# EAGLE design gbaadapter (EAGLE 7.6.0)
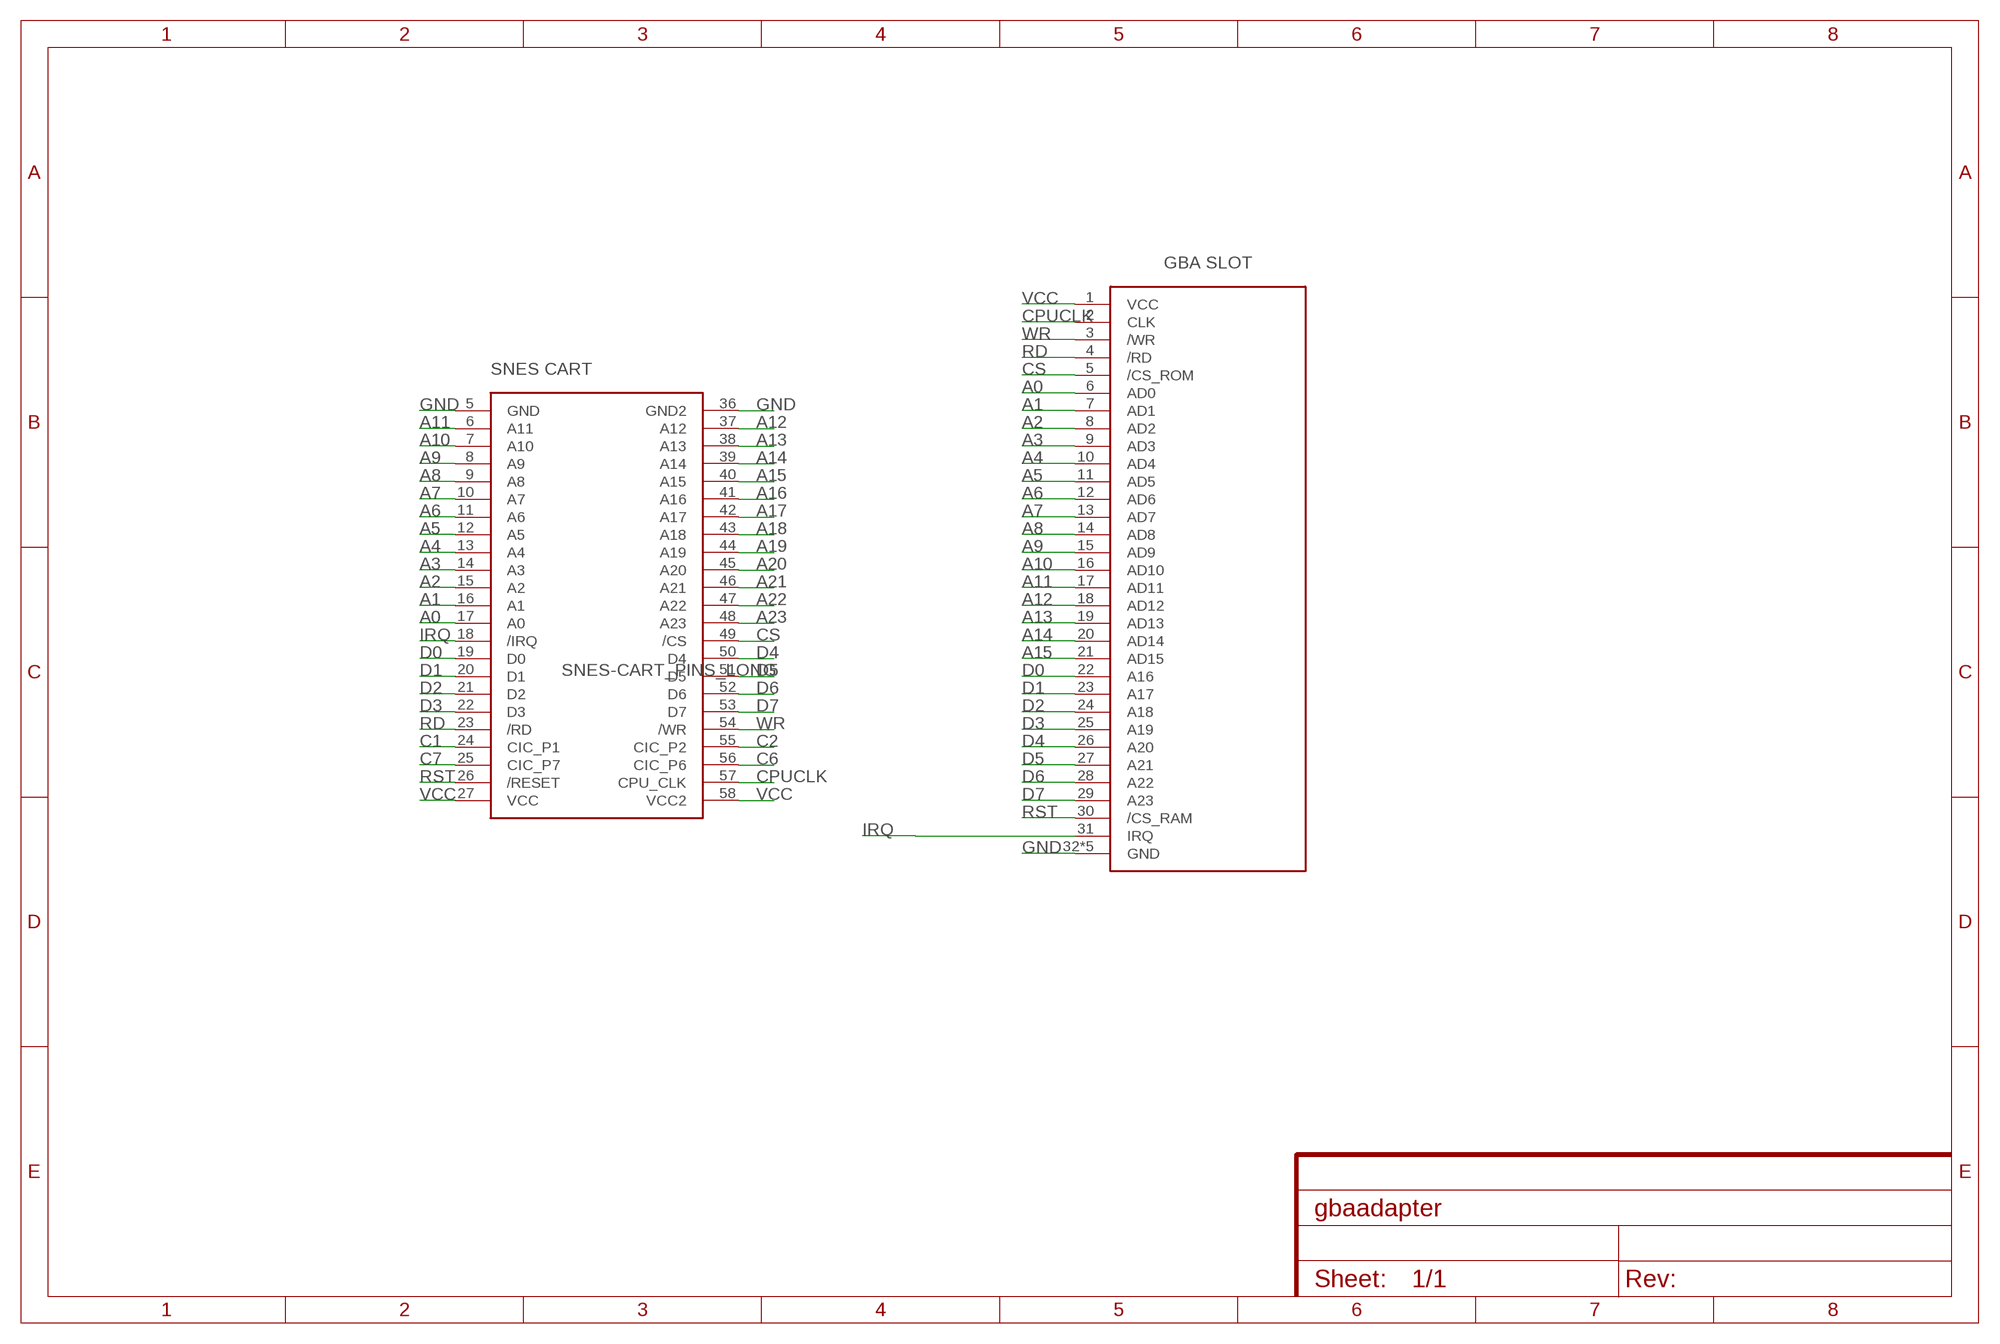
[diagram p0: schematic, sheet 1]

## Parts
U$1  SNES-CART_PINS_LONG  [SNESCART_PINS_LONG]
U$2  GBA-SLOTSMD  [GBA-SLOT]

## Nets
A0: U$1.17(A0) U$2.6(AD0)
A1: U$1.16(A1) U$2.7(AD1)
A2: U$1.15(A2) U$2.8(AD2)
A3: U$1.14(A3) U$2.9(AD3)
A4: U$1.13(A4) U$2.10(AD4)
A5: U$1.12(A5) U$2.11(AD5)
A6: U$1.11(A6) U$2.12(AD6)
A7: U$1.10(A7) U$2.13(AD7)
A8: U$1.9(A8) U$2.14(AD8)
A9: U$1.8(A9) U$2.15(AD9)
A10: U$1.7(A10) U$2.16(AD10)
A11: U$1.6(A11) U$2.17(AD11)
A12: U$1.37(A12) U$2.18(AD12)
A13: U$1.38(A13) U$2.19(AD13)
A14: U$1.39(A14) U$2.20(AD14)
A15: U$1.40(A15) U$2.21(AD15)
A16: U$1.41(A16)
A17: U$1.42(A17)
A18: U$1.43(A18)
A19: U$1.44(A19)
A20: U$1.45(A20)
A21: U$1.46(A21)
A22: U$1.47(A22)
A23: U$1.48(A23)
C1: U$1.24(CIC_P1)
C2: U$1.55(CIC_P2)
C6: U$1.56(CIC_P6)
C7: U$1.25(CIC_P7)
CPUCLK: U$1.57(CPU_CLK) U$2.2(CLK)
CS: U$1.49(/CS) U$2.5(/CS_ROM)
D0: U$1.19(D0) U$2.22(A16)
D1: U$1.20(D1) U$2.23(A17)
D2: U$1.21(D2) U$2.24(A18)
D3: U$1.22(D3) U$2.25(A19)
D4: U$1.50(D4) U$2.26(A20)
D5: U$1.51(D5) U$2.27(A21)
D6: U$1.52(D6) U$2.28(A22)
D7: U$1.53(D7) U$2.29(A23)
GND [gnd]: U$1.5(GND) U$1.36(GND2) U$2.32(GND) U$2.SHIELD_1(GND) U$2.SHIELD_2(GND) U$2.SHIELD_3(GND) U$2.SHIELD_4(GND)
IRQ: U$1.18(/IRQ) U$2.31(IRQ)
RD: U$1.23(/RD) U$2.4(/RD)
RST: U$1.26(/RESET) U$2.30(/CS_RAM)
VCC [power]: U$1.27(VCC) U$1.58(VCC2) U$2.1(VCC)
WR: U$1.54(/WR) U$2.3(/WR)

## Library data of the parts
U$1 = !sanni_mod2:SNES-CART_PINS_LONG
U$2 = !sanni:GBA-SLOT

## Net classes
0 default: width 0.305 mm, drill 0.406 mm, clearance 0.203 mm
1 power: width 0.61 mm, drill 0.406 mm, clearance 0.203 mm
2 gnd: width 0.61 mm, drill 0.406 mm, clearance 0.203 mm

## Board
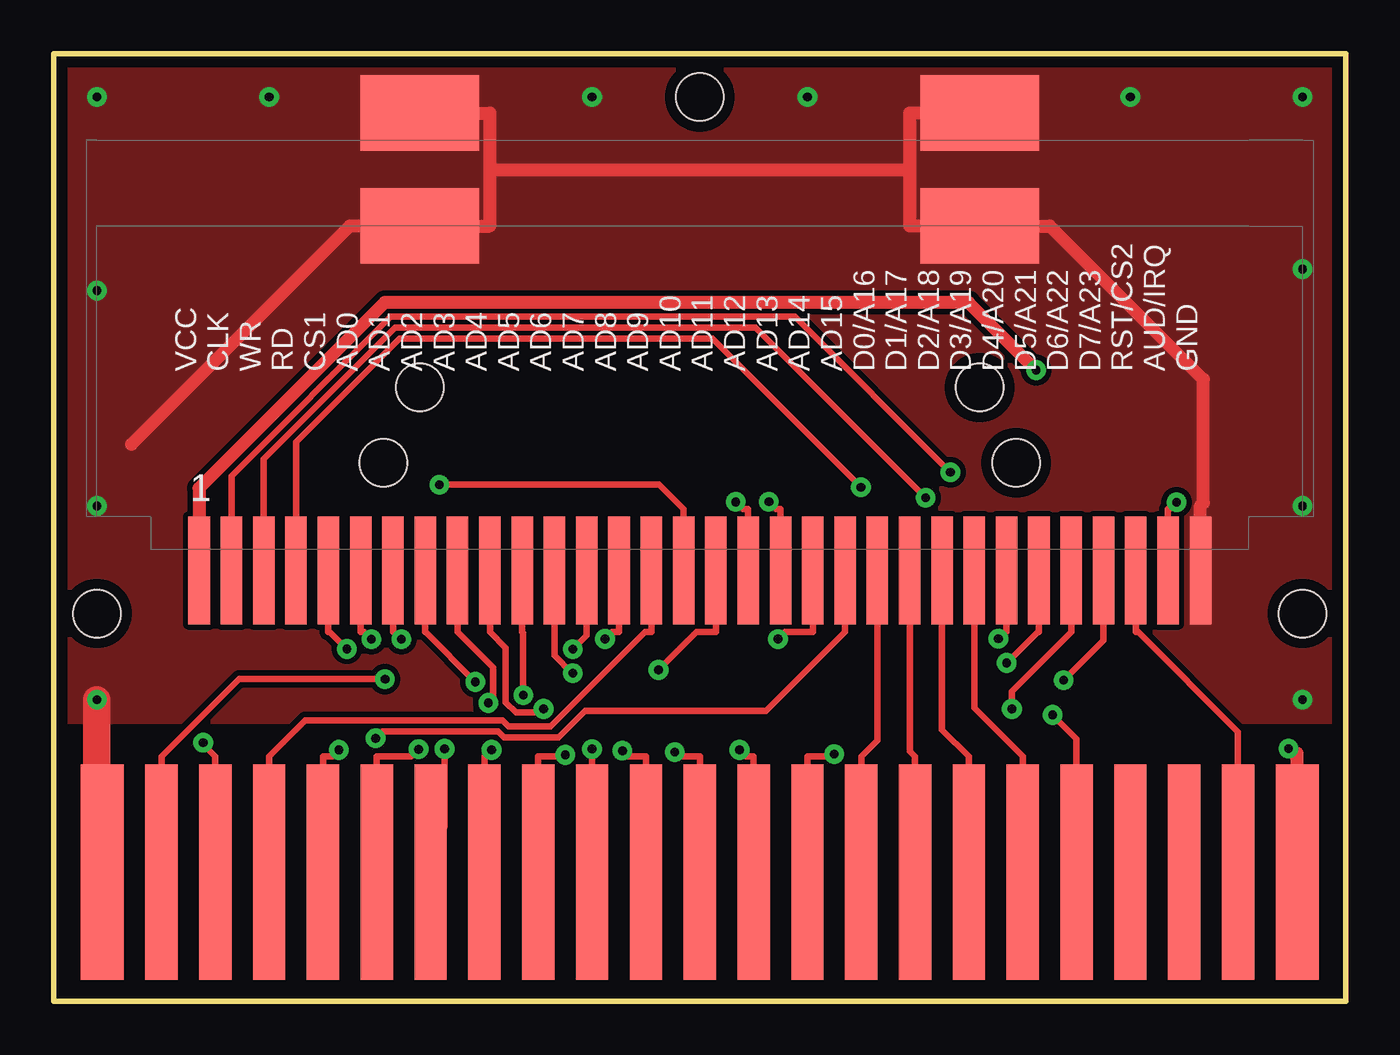
[diagram p1: board, top side]
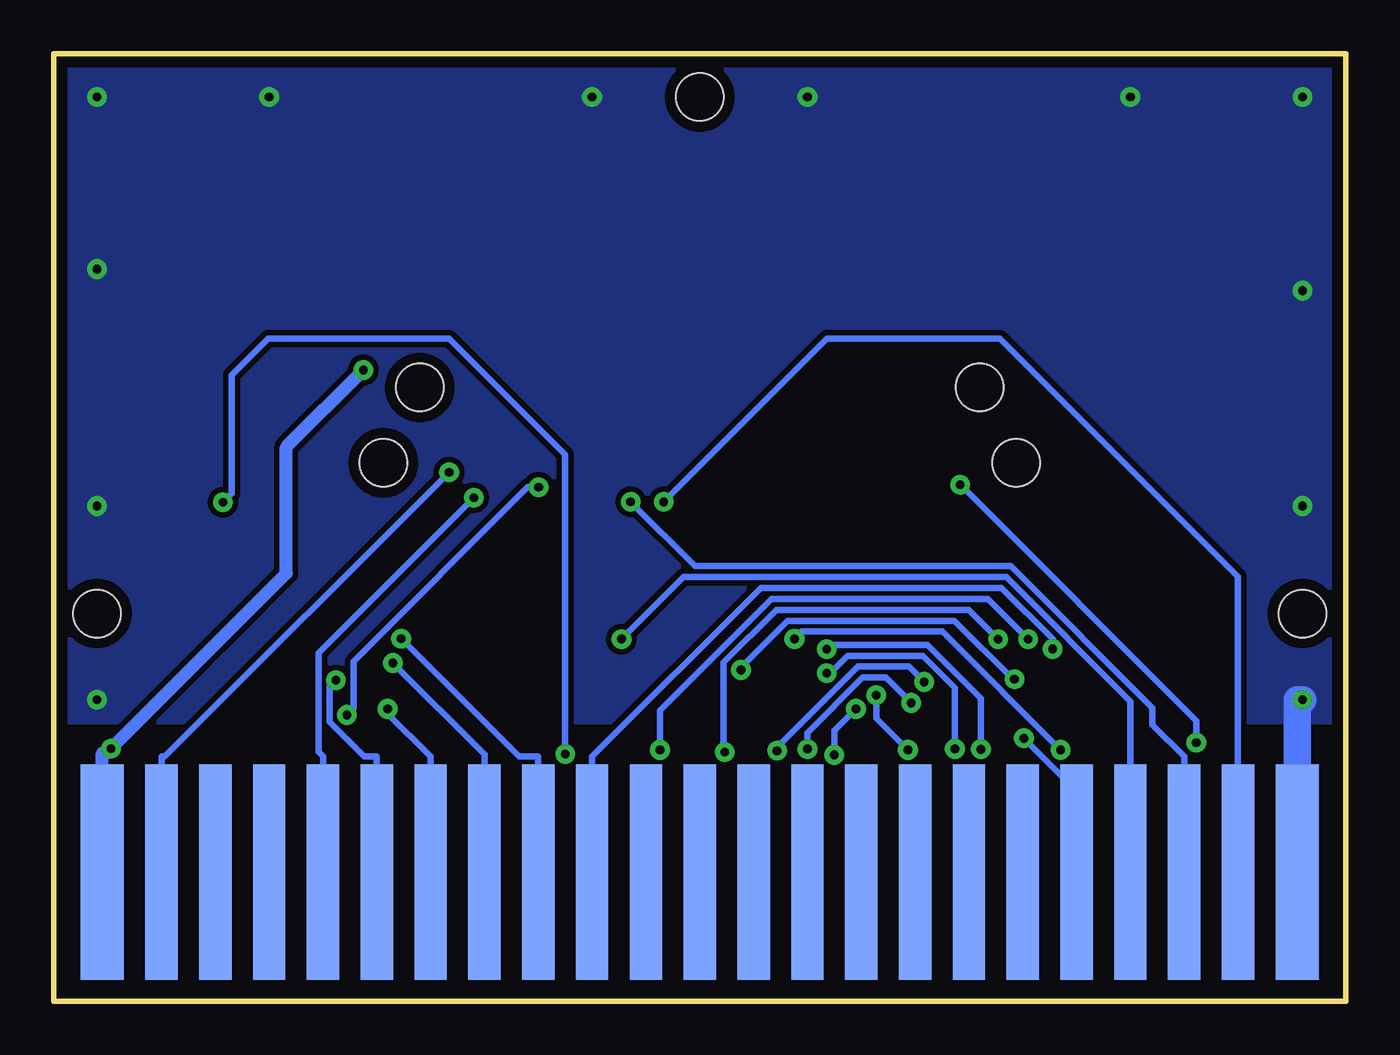
[diagram p2: board, bottom side, seen from below]

Size 60 x 44 mm. Coordinates in mm from the lower left corner, seen from the top.
Outline: 0,0 60,0 60,44 0,44 0,0
Copper layers (1*16): Top 0.035mm / dielectric 1.5mm / Bottom 0.035mm
Design rules "SparkFun_mod": minimum track width 8mil, minimum drill 16mil, track to track 8mil, track to pad 8mil, pad to pad 8mil, via to via 8mil, smd to smd 8mil, copper to edge 20mil, drill to drill 12mil, minimum pad ring 12mil, minimum via ring 10mil, stop-mask expansion 4mil, vias tented up to drill 25mil, thermal gap 10mil
Holes 2.2 mm at 2,18 58,18 30,42

### Footprints (pad centres in the part's own frame; a part is rotated, then mirrored left to right if it is on the bottom)
SNESCART_PINS_LONG = smd 2 x 10: 5 -27.75,-2; 27 27.75,-2 | smd 1.5 x 10: 6 -25,-2; 7 -22.5,-2; 8 -20,-2; 9 -17.5,-2; 10 -15,-2; 11 -12.5,-2; 12 -10,-2; 13 -7.5,-2; 14 -5,-2; 15 -2.5,-2; 16 0,-2; 17 2.5,-2; 18 5,-2; 19 7.5,-2; 20 10,-2; 21 12.5,-2; 22 15,-2; 23 17.5,-2; 24 20,-2; 25 22.5,-2; 26 25,-2 | smd 2 x 10 bottom: 36 -27.75,-2; 58 27.75,-2 | smd 1.5 x 10 bottom: 37 -25,-2; 38 -22.5,-2; 39 -20,-2; 40 -17.5,-2; 41 -15,-2; 42 -12.5,-2; 43 -10,-2; 44 -7.5,-2; 45 -5,-2; 46 -2.5,-2; 47 0,-2; 48 2.5,-2; 49 5,-2; 50 7.5,-2; 51 10,-2; 52 12.5,-2; 53 15,-2; 54 17.5,-2; 55 20,-2; 56 22.5,-2; 57 25,-2
GBA-SLOT = smd 5 x 1: 1 -5,23.25; 2 -5,21.75; 3 -5,20.25; 4 -5,18.75; 5 -5,17.25; 6 -5,15.75; 7 -5,14.25; 8 -5,12.75; 9 -5,11.25; 10 -5,9.75; 11 -5,8.25; 12 -5,6.75; 13 -5,5.25; 14 -5,3.75; 15 -5,2.25; 16 -5,0.75; 17 -5,-0.75; 18 -5,-2.25; 19 -5,-3.75; 20 -5,-5.25; 21 -5,-6.75; 22 -5,-8.25; 23 -5,-9.75; 24 -5,-11.25; 25 -5,-12.75; 26 -5,-14.25; 27 -5,-15.75; 28 -5,-17.25; 29 -5,-18.75; 30 -5,-20.25; 31 -5,-21.75; 32 -5,-23.25 | smd 3.5 x 5.5: SHIELD_1 11,13; SHIELD_2 11,-13; SHIELD_3 16.25,13; SHIELD_4 16.25,-13 | hole 2.2: 0,14.7; 0,-14.7; 3.5,13; 3.5,-13

### Placement (x,y rotation side)
U$1  30,8 0 top
U$2  30,25 90 top

### Tracks (layer width: path | path; a pad name or v marks a point on that pad's centre or on a via)
A0  (via drill 0.41 pad 0.91)
  Top 0.305: v14.75,16.81 14.41,17.14 14.25,17.14 U$2.6 | v31.85,11.67 32.16,11.36 32.5,11.36 U$1.17
  Bottom 0.305: v31.85,11.67 31.85,13.5 26.66,18.68 16.62,18.68 v14.75,16.81
A1  (via drill 0.41 pad 0.91)
  Top 0.305: v16.15,16.81 16.08,16.81 15.75,17.14 U$2.7 | U$1.16 30,11.36 29.04,11.36 v28.84,11.56
  Bottom 0.305: v28.84,11.56 28.91,11.62 28.91,15.72 26.45,18.18 17.51,18.18 v16.15,16.81
A2  (via drill 0.41 pad 0.91)
  Top 0.305: v19.58,14.82 17.26,17.14 17.25,17.14 U$2.8 | v26.41,11.63 26.68,11.36 27.5,11.36 U$1.15
  Bottom 0.305: v26.41,11.63 26.41,11.78 22.65,15.53 20.29,15.53 v19.58,14.82
A3  (via drill 0.41 pad 0.91)
  Top 0.305: v20.18,13.85 20.39,14.06 20.39,15.5 18.75,17.14 U$2.9 | U$1.14 v25,11.71 | v25,11.71
  Bottom 0.305: v25,11.71 25,12.46 22.44,15.03 21.36,15.03 v20.18,13.85
A4  (via drill 0.41 pad 0.91)
  Top 0.305: v22.74,13.57 22.57,13.4 21.46,13.4 20.99,13.87 20.99,16.4 20.25,17.14 U$2.10 | v23.75,11.44 23.67,11.36 22.5,11.36 U$1.13
  Bottom 0.305: v23.75,11.44 23.75,12.56 v22.74,13.57
A5  (via drill 0.41 pad 0.91)
  Top 0.305: v21.8,14.21 21.8,17.09 21.75,17.14 U$2.11 | v20.33,11.66 20.31,11.66 20,11.36 U$1.12
  Bottom 0.305: v21.8,14.21 21.8,13.14 v20.33,11.66
A6  (via drill 0.41 pad 0.91)
  Top 0.305: v24.1,15.23 24.07,15.23 23.25,16.05 23.25,17.14 U$2.12 | v18.15,11.71 18.15,8.15 U$1.11
  Bottom 0.305: v24.1,15.23 23.96,15.23 23.15,16.04 19.64,16.04 18.15,14.54 v18.15,11.71
A7  (via drill 0.41 pad 0.91)
  Top 0.305: v24.1,16.35 24.75,16.99 24.75,17.14 U$2.13 | v16.94,11.7 16.6,11.36 15,11.36 U$1.10
  Bottom 0.305: v24.1,16.35 23.9,16.55 19.43,16.55 16.94,14.06 v16.94,11.7
A8  (via drill 0.41 pad 0.91)
  Top 0.305: U$2.14 26.25,17.14 25.93,17.14 v25.6,16.82 | v13.24,11.66 12.93,11.36 12.5,11.36 U$1.9
  Bottom 0.305: v25.6,16.82 25.27,17.16 18.73,17.16 v13.24,11.66
A9
  Top 0.305: U$2.15 27.75,17.14 27.47,17.14 23.08,12.76 21.12,12.76 20.84,13.04 11.68,13.04 10,11.36 U$1.8
A10  (via drill 0.41 pad 0.91)
  Top 0.305: v17.9,23.99 28.12,23.99 29.25,22.86 U$2.16 | v6.94,12 6.94,11.92 7.5,11.36 U$1.7
  Bottom 0.305: v17.9,23.99 6.94,13.02 v6.94,12
A11  (via drill 0.41 pad 0.91)
  Top 0.305: v15.38,14.96 8.6,14.96 5,11.36 U$1.6 | U$2.17 30.75,17.14 29.84,17.14 v28.09,15.38
  Bottom 0.305: v28.09,15.38 28.09,15.5 25.92,17.67 18.17,17.67 15.46,14.96 v15.38,14.96
A12  (via drill 0.41 pad 0.91)
  Top 0.305: v31.68,23.19 32.01,22.86 32.25,22.86 U$2.18
  Bottom 0.305: U$1.37 5,19.71 16.06,30.77 24.09,30.77 v31.68,23.19
A13  (via drill 0.41 pad 0.91)
  Top 0.305: U$2.19 33.75,22.86 33.55,22.86 v33.21,23.19
  Bottom 0.305: v33.21,23.19 30.23,20.21 15.56,20.21 8.97,13.62 8.97,12.83 7.5,11.36 U$1.38
A14  (via drill 0.41 pad 0.91)
  Top 0.305: v33.64,16.82 33.97,17.14 35.25,17.14 U$2.20
  Bottom 0.305: v33.64,16.82 30.75,19.7 15.77,19.7 10,13.93 10,11.36 U$1.39
A15  (via drill 0.41 pad 0.91)
  Top 0.305: U$2.21 36.75,17.14 33.08,13.47 24.66,13.47 23.44,12.25 20.91,12.25 20.63,12.53 15.27,12.53 v14.95,12.21
  Bottom 0.305: v14.95,12.21 12.5,9.76 U$1.40
CPUCLK  (via drill 0.41 pad 0.91)
  Top 0.305: v41.65,24.56 34.42,31.79 15.64,31.79 8.25,24.4 U$2.2
  Bottom 0.305: U$1.57 55,11.36 54.85,11.36 v41.65,24.56
CS  (via drill 0.41 pad 0.91)
  Top 0.305: v13.61,16.36 12.82,17.14 12.75,17.14 U$2.5
  Bottom 0.305: v13.61,16.36 13.61,16.82 15.98,19.19 27.16,19.19 35,11.36 U$1.49
D0
  Top 0.305: U$1.19 37.5,11.36 38.25,12.11 U$2.22
D1
  Top 0.305: U$1.20 40,11.36 39.75,11.61 39.75,17.14 U$2.23
D2
  Top 0.305: U$1.21 42.5,11.36 41.25,12.61 41.25,17.14 U$2.24
D3
  Top 0.305: U$1.22 45,11.36 42.75,13.61 42.75,17.14 U$2.25
D4  (via drill 0.41 pad 0.91)
  Top 0.305: v43.87,16.84 44.18,17.14 44.25,17.14 U$2.26
  Bottom 0.305: v43.87,16.84 38.39,11.36 37.5,11.36 U$1.50
D5  (via drill 0.41 pad 0.91)
  Top 0.305: v44.26,15.71 45.7,17.14 45.75,17.14 U$2.27
  Bottom 0.305: v44.26,15.71 40,11.45 40,11.36 U$1.51
D6  (via drill 0.41 pad 0.91)
  Top 0.305: v44.49,13.57 44.49,14.39 47.25,17.14 U$2.28
  Bottom 0.305: v44.49,13.57 44.49,13.35 42.5,11.36 U$1.52
D7  (via drill 0.41 pad 0.91)
  Top 0.305: U$2.29 48.75,16.76 v46.9,14.9
  Bottom 0.305: U$1.53 45,11.36 45.6,11.36 47.2,12.96 47.2,14.6 v46.9,14.9
GND  (via drill 0.41 pad 0.91)
  Top 0.61: 20.26,38.62 20.26,41.25 U$2.SHIELD_3 | 20.26,38.62 20.26,36 U$2.SHIELD_1 13.74,36 3.6,25.86 | 39.74,38.62 39.74,36 U$2.SHIELD_2 46.26,36 53.39,28.87 53.39,23.15 53.25,23.01 U$2.32 | 39.74,38.62 39.74,41.25 U$2.SHIELD_4 | 20.26,38.62 39.74,38.62
  Top 1.27: U$1.36 2,7.5 v2,14
  Bottom 1.27: v2,14 2.25,14 U$1.36
  other vias: 2,23 2,33 2,42 10,42 25,42 35,42 50,42 58,42 58,34 58,23 58,14
  pour Top (isolate 0.254, no thermals): 0,13 0,44 60,44 60,13
  pour Bottom (isolate 0.254, no thermals): 0,13 0,44 60,44 60,13
IRQ  (via drill 0.41 pad 0.91)
  Top 0.305: U$1.18 35,11.36 36.14,11.36 v36.25,11.47 | v52.15,23.17 51.83,22.86 51.75,22.86 U$2.31
  Bottom 0.305: v36.25,11.47 36.25,25.39 41.63,30.77 50.05,30.77 51.75,29.08 51.75,25.67 51.75,23.57 v52.15,23.17
RD  (via drill 0.41 pad 0.91)
  Top 0.305: v46.39,13.3 47.5,12.18 U$1.23 | U$2.4 11.25,25.96 16.06,30.77 30.59,30.77 v37.49,23.87
  Bottom 0.305: v37.49,23.87 37.99,23.87 46.08,15.78 46.08,13.6 v46.39,13.3
RST
  Top 0.305: U$1.26 55,12.51 50.37,17.14 50.25,17.14 U$2.30
VCC  (via drill 0.41 pad 0.91)
  Top 0.61: v45.62,29.31 42.48,32.45 15.37,32.45 6.75,23.83 U$2.1 | v57.34,11.73 57.56,11.51 57.75,11.51 U$1.27
  Bottom 0.61: v45.62,29.31 49.2,25.73 49.2,19.87 v57.34,11.73 57.56,11.51 57.75,11.51 U$1.27
WR  (via drill 0.41 pad 0.91)
  Top 0.305: U$2.3 9.75,22.86 9.75,25.18 15.85,31.28 32.6,31.28 v40.49,23.38
  Bottom 0.305: U$1.54 47.5,11.36 47.71,11.57 47.71,16.16 v40.49,23.38

### Text on the board
tNames: VCC / CLK / WR / RD / CS1 / AD0 / AD1 / AD2 / AD3 / AD4 / AD5 / AD6 / AD7 / AD8 / AD9 / AD10 / AD11 / AD12 / AD13 / AD14 / AD15 / D0/A16 / D1/A17 / D2/A18 / D3/A19 / D4/A20 / D5/A21 / D6/A22 / D7/A23 / RST/CS2 / AUD/IRQ / GND